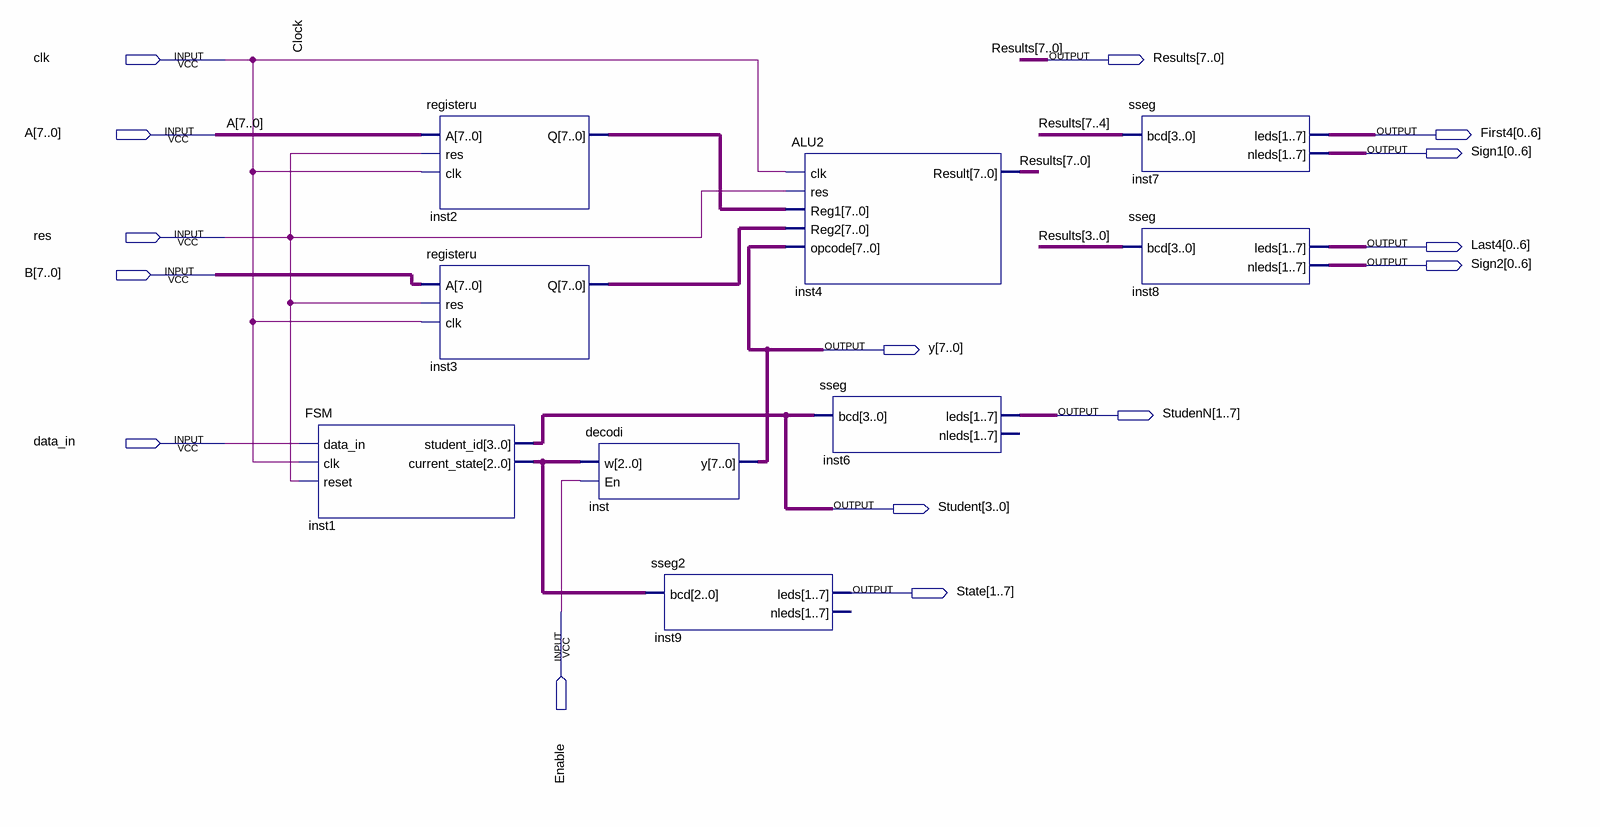
[diagram p0: schematic sheet]
// Quartus schematic CPU2.bdf as structural Verilog: 9 symbols, 15 pins
module CPU2 (
  input  clk,
  input  [7:0] A,
  input  res,
  input  [7:0] B,
  input  data_in,
  input  Enable,
  output [7:0] Results,
  output [0:6] First4,
  output [0:6] Sign1,
  output [0:6] Last4,
  output [0:6] Sign2,
  output [7:0] y,
  output [1:7] StudenN,
  output [3:0] Student,
  output [1:7] State
);

  wire [2:0] inst1_current_state;
  wire [7:0] inst2_q, inst3_q;

  FSM inst1 (.data_in(data_in), .clk(clk), .reset(res), .student_id(Student), .current_state(inst1_current_state));
  registeru inst2 (.A(A), .res(res), .clk(clk), .Q(inst2_q));
  registeru inst3 (.A(B), .res(res), .clk(clk), .Q(inst3_q));
  decodi inst (.w(inst1_current_state), .En(Enable), .y(y));
  sseg2 inst9 (.bcd(inst1_current_state), .leds(State));  // open: nleds
  ALU2 inst4 (.clk(clk), .res(res), .Reg1(inst2_q), .Reg2(inst3_q), .opcode(y), .Result(Results));
  sseg inst6 (.bcd(Student), .leds(StudenN));  // open: nleds
  sseg inst7 (.bcd(Results[7:4]), .leds(First4), .nleds(Sign1));
  sseg inst8 (.bcd(Results[3:0]), .leds(Last4), .nleds(Sign2));

  // Other names for the same wires on the sheet: Clock = clk
endmodule
